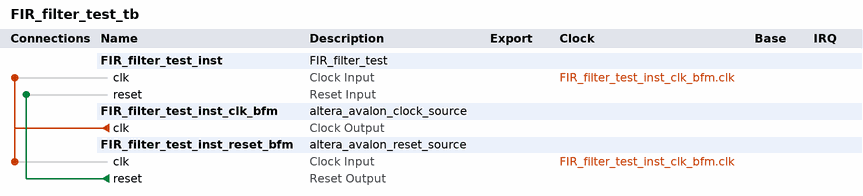
[diagram p0: system contents]
# Platform Designer (Qsys) system FIR_filter_test_tb, Cyclone V 5CSEMA5F31C6
# Parameters at their usual value, and those the tool derives, are not listed.
package require -exact qsys 17.1
create_system FIR_filter_test_tb
set_project_property DEVICE_FAMILY {Cyclone V}
set_project_property DEVICE 5CSEMA5F31C6

add_instance FIR_filter_test_inst FIR_filter_test 1.0

add_instance FIR_filter_test_inst_clk_bfm altera_avalon_clock_source 17.1

add_instance FIR_filter_test_inst_reset_bfm altera_avalon_reset_source 17.1
set_instance_parameter_value FIR_filter_test_inst_reset_bfm ASSERT_HIGH_RESET 0
set_instance_parameter_value FIR_filter_test_inst_reset_bfm INITIAL_RESET_CYCLES 50

# connections
add_connection FIR_filter_test_inst_clk_bfm.clk FIR_filter_test_inst.clk clock
add_connection FIR_filter_test_inst_clk_bfm.clk FIR_filter_test_inst_reset_bfm.clk clock
add_connection FIR_filter_test_inst_reset_bfm.reset FIR_filter_test_inst.reset reset

set_interconnect_requirement {$system} qsys_mm.clockCrossingAdapter HANDSHAKE
set_interconnect_requirement {$system} qsys_mm.enableEccProtection FALSE
set_interconnect_requirement {$system} qsys_mm.insertDefaultSlave FALSE
set_interconnect_requirement {$system} qsys_mm.maxAdditionalLatency 1

save_system FIR_filter_test_tb.qsys
